# Altium schematic sheet Tester Harness with Termination.SchDoc
size A4
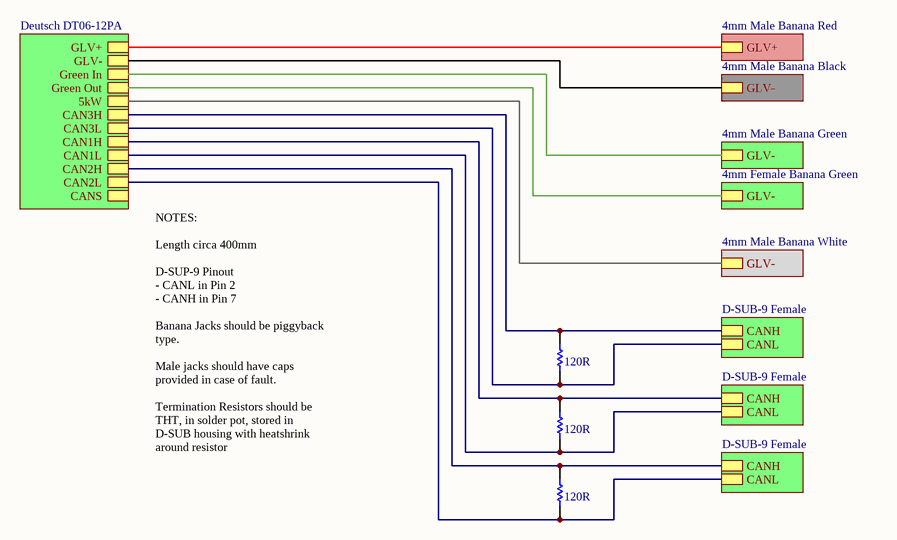
[diagram p0: Tester Harness with Termination.SchDoc]

## Parts
(Parts that share a designator on the sheet are numbered #1, #2 ... from top to bottom, then left to right.)
R?#1  value 120R  [AXIAL-0.3]  (hidden comment: Res1)
R?#2  value 120R  [AXIAL-0.3]  (hidden comment: Res1)
R?#3  value 120R  [AXIAL-0.3]  (hidden comment: Res1)

## Sub-sheets
4mm Female Banana Green = File Name: GLV-
4mm Male Banana Black = File Name: GLV-
4mm Male Banana Green = File Name: GLV-
4mm Male Banana Red = File Name: GLV+
4mm Male Banana White = File Name: GLV-
D-SUB-9 Female = File Name: CANH, CANL
D-SUB-9 Female = File Name: CANH, CANL
D-SUB-9 Female = File Name: CANH, CANL
Deutsch DT06-12PA = File Name: GLV+, GLV-, CAN1H, CAN3H, CAN3L, CAN2H, CAN1L, CAN2L, CANS, Green Out, Green In, 5kW

## Nets
NetR?#1_1: R?#1.1 ; sheet Deutsch DT06-12PA/CAN3L, sheet D-SUB-9 Female/CANL
NetR?#1_2: R?#1.2 ; sheet Deutsch DT06-12PA/CAN3H, sheet D-SUB-9 Female/CANH
NetR?#2_1: R?#2.1 ; sheet Deutsch DT06-12PA/CAN1L, sheet D-SUB-9 Female/CANL
NetR?#2_2: R?#2.2 ; sheet Deutsch DT06-12PA/CAN1H, sheet D-SUB-9 Female/CANH
NetR?#3_1: R?#3.1 ; sheet Deutsch DT06-12PA/CAN2L, sheet D-SUB-9 Female/CANL
NetR?#3_2: R?#3.2 ; sheet Deutsch DT06-12PA/CAN2H, sheet D-SUB-9 Female/CANH
(unnamed): sheet Deutsch DT06-12PA/GLV+, sheet 4mm Male Banana Red/GLV+
(unnamed): sheet Deutsch DT06-12PA/GLV-, sheet 4mm Male Banana Black/GLV-
(unnamed): sheet Deutsch DT06-12PA/Green Out, sheet 4mm Female Banana Green/GLV-
(unnamed): sheet Deutsch DT06-12PA/Green In, sheet 4mm Male Banana Green/GLV-
(unnamed): sheet Deutsch DT06-12PA/5kW, sheet 4mm Male Banana White/GLV-

## Notes on the sheet
- NOTES:
  Length circa 400mm
  D-SUP-9 Pinout
  - CANL in Pin 2
  - CANH in Pin 7
  Banana Jacks should be piggyback type.
  Male jacks should have caps provided in case of fault.
  Termination Resistors should be THT, in solder pot, stored in D-SUB housing with heatshrink around resistor

## Library data of the parts
R?#1-R?#3 = Res1: Resistor; Published: 8-Jun-2000; LatestRevisionDate: 17-Jul-2002; LatestRevisionNote: Re-released for DXP Platform.; PackageReference: AXIAL-0.3; Publisher: Altium Limited; PackageDescription: Axial Device, Thru-Hole; 2 Leads; 0.3 in Pin Spacing